# Altium schematic sheet ad_1.schdoc
size A4
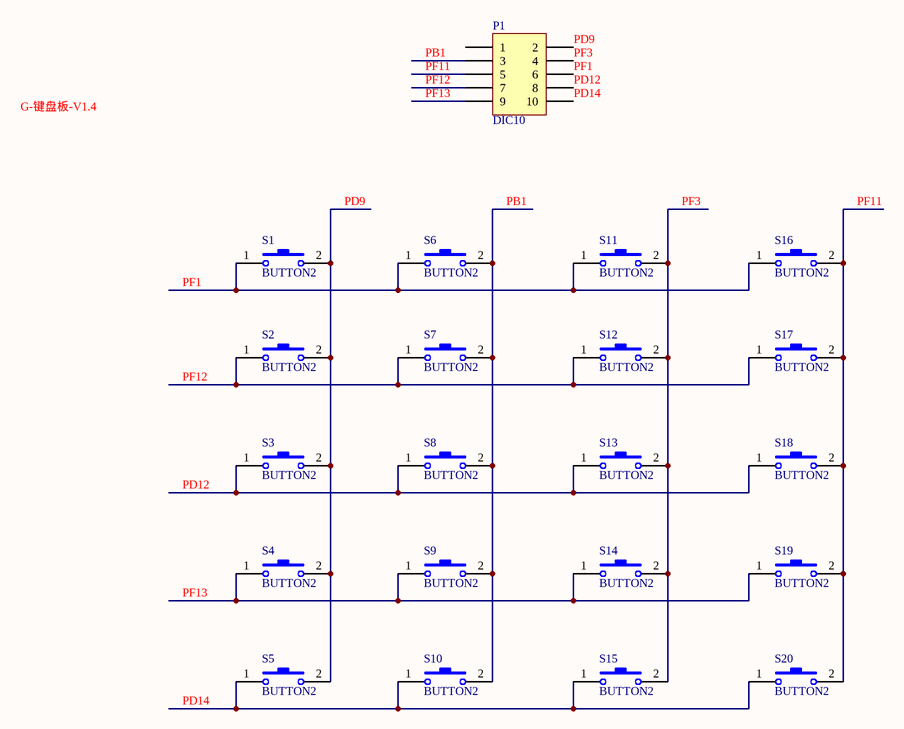
[diagram p0: ad_1.schdoc]

## Parts
P1  DIC10
S1  BUTTON2  [BUTTON-SMD-7*7]
S2  BUTTON2  [BUTTON-SMD-7*7]
S3  BUTTON2  [BUTTON-SMD-7*7]
S4  BUTTON2  [BUTTON-SMD-7*7]
S5  BUTTON2  [BUTTON-SMD-7*7]
S6  BUTTON2  [BUTTON-SMD-7*7]
S7  BUTTON2  [BUTTON-SMD-7*7]
S8  BUTTON2  [BUTTON-SMD-7*7]
S9  BUTTON2  [BUTTON-SMD-7*7]
S10  BUTTON2  [BUTTON-SMD-7*7]
S11  BUTTON2  [BUTTON-SMD-7*7]
S12  BUTTON2  [BUTTON-SMD-7*7]
S13  BUTTON2  [BUTTON-SMD-7*7]
S14  BUTTON2  [BUTTON-SMD-7*7]
S15  BUTTON2  [BUTTON-SMD-7*7]
S16  BUTTON2  [BUTTON-SMD-7*7]
S17  BUTTON2  [BUTTON-SMD-7*7]
S18  BUTTON2  [BUTTON-SMD-7*7]
S19  BUTTON2  [BUTTON-SMD-7*7]
S20  BUTTON2  [BUTTON-SMD-7*7]

## Nets
PB1: P1.3 S6.2 S7.2 S8.2 S9.2 S10.2
PD9: P1.2 S1.2 S2.2 S3.2 S4.2 S5.2
PD12: P1.8 S3.1 S8.1 S13.1 S18.1
PD14: P1.10 S5.1 S10.1 S15.1 S20.1
PF1: P1.6 S1.1 S6.1 S11.1 S16.1
PF3: P1.4 S11.2 S12.2 S13.2 S14.2 S15.2
PF11: P1.5 S16.2 S17.2 S18.2 S19.2 S20.2
PF12: P1.7 S2.1 S7.1 S12.1 S17.1
PF13: P1.9 S4.1 S9.1 S14.1 S19.1

Not connected (* = marked no-connect by the designer): P1 1

## Notes on the sheet
- Labels drawn without touching a wire or pin: G-键盘板-V1.4

## Library data of the parts
P1 = DIC10: 连接器; LatestRevisionDate: 17-Jul-2002; LatestRevisionNote: Re-released for DXP Platform.; Publisher: Altium Limited
S1-S20 = BUTTON2: 按钮; Published: 24-Mar-1999; LatestRevisionDate: 17-Jul-2002; LatestRevisionNote: Re-released for DXP Platform.; PackageReference: SPST-2; Publisher: Altium Limited; PackageDescription: Switch; 2 Leads